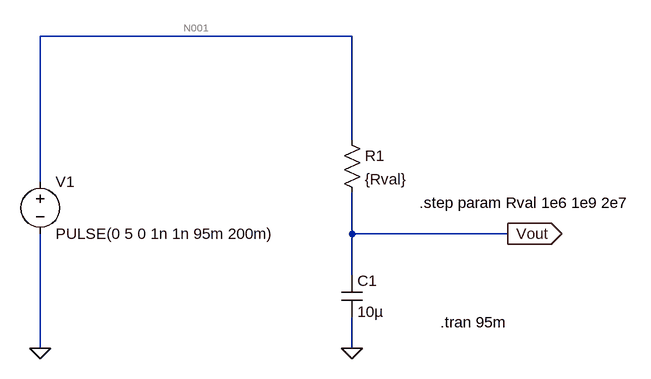
[diagram p0: schematic rc_open_sweep.asc]
rc_open_sweep.asc, the LTspice schematic file:
Version 4.1
SHEET 1 880 680
WIRE -512 -64 -992 -64
WIRE -512 96 -512 -64
WIRE -992 160 -992 -64
WIRE -512 240 -512 176
WIRE -272 240 -512 240
WIRE -512 304 -512 240
WIRE -992 416 -992 240
WIRE -512 416 -512 368
FLAG -272 240 Vout
IOPIN -272 240 Out
FLAG -992 416 0
FLAG -512 416 0
SYMBOL voltage -992 144 R0
WINDOW 123 0 0 Left 0
WINDOW 39 0 0 Left 0
SYMATTR InstName V1
SYMATTR Value PULSE(0 5 0 1n 1n 95m 200m)
SYMBOL res -528 80 R0
SYMATTR InstName R1
SYMATTR Value {Rval}
SYMBOL cap -528 304 R0
SYMATTR InstName C1
SYMATTR Value 10µ
SYMATTR SpiceLine V=6.3 Irms=0 Rser=4 Lser=0 mfg="AVX" pn="TAJA106M006" type="Tantalum"
TEXT -376 376 Left 2 !.tran 95m
TEXT -408 192 Left 2 !.step param Rval 1e6 1e9 2e7

The netlist it stands for:
* rc_open_sweep.asc
V1 N001 0 PULSE(0 5 0 1n 1n 95m 200m)
R1 N001 Vout {Rval}
C1 Vout 0 10µ V=6.3 Irms=0 Rser=4 Lser=0 mfg="AVX" pn="TAJA106M006" type="Tantalum"
.tran 95m
.step param Rval 1e6 1e9 2e7
.backanno
.end

* Results of the author's LTspice run, read from the files saved beside the schematic
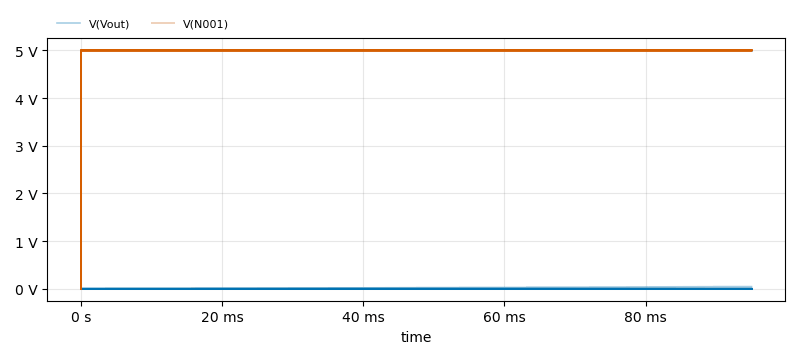
[diagram p1: Transient Analysis of rc_open_sweep.asc, plotted from the saved traces]
* Transient Analysis, 51 runs:
*   V(Vout) [run 1]: min 0 V, max 47.29 mV, average 23.69 mV, rms 27.34 mV, last 47.29 mV
*   V(Vout) [run 2]: min 0 V, max 779 µV, average 389.7 µV, rms 449.8 µV, last 779 µV
*   V(Vout) [run 3]: min 0 V, max 392.7 µV, average 196.4 µV, rms 226.8 µV, last 392.7 µV
*   V(Vout) [run 4]: min 0 V, max 236.4 µV, average 118.3 µV, rms 136.5 µV, last 236.4 µV
*   V(Vout) [run 5]: min 0 V, max 182.1 µV, average 91.07 µV, rms 105.1 µV, last 182.1 µV
*   V(Vout) [run 6]: min 0 V, max 148 µV, average 74.05 µV, rms 85.49 µV, last 148 µV
*   V(Vout) [run 7]: min 0 V, max 118.5 µV, average 59.28 µV, rms 68.43 µV, last 118.5 µV
*   V(Vout) [run 8]: min 0 V, max 103.1 µV, average 51.56 µV, rms 59.53 µV, last 103.1 µV
*   V(N001) [run 1]: min 0 V, max 5 V, average 5 V, rms 5 V, last 5 V
*   V(N001) [run 2]: min 0 V, max 5 V, average 5 V, rms 5 V, last 5 V
*   V(N001) [run 3]: min 0 V, max 5 V, average 5 V, rms 5 V, last 5 V
*   V(N001) [run 4]: min 0 V, max 5 V, average 5 V, rms 5 V, last 5 V
*   V(N001) [run 5]: min 0 V, max 5 V, average 5 V, rms 5 V, last 5 V
*   V(N001) [run 6]: min 0 V, max 5 V, average 5 V, rms 5 V, last 5 V
*   V(N001) [run 7]: min 0 V, max 5 V, average 5 V, rms 5 V, last 5 V
*   V(N001) [run 8]: min 0 V, max 5 V, average 5 V, rms 5 V, last 5 V